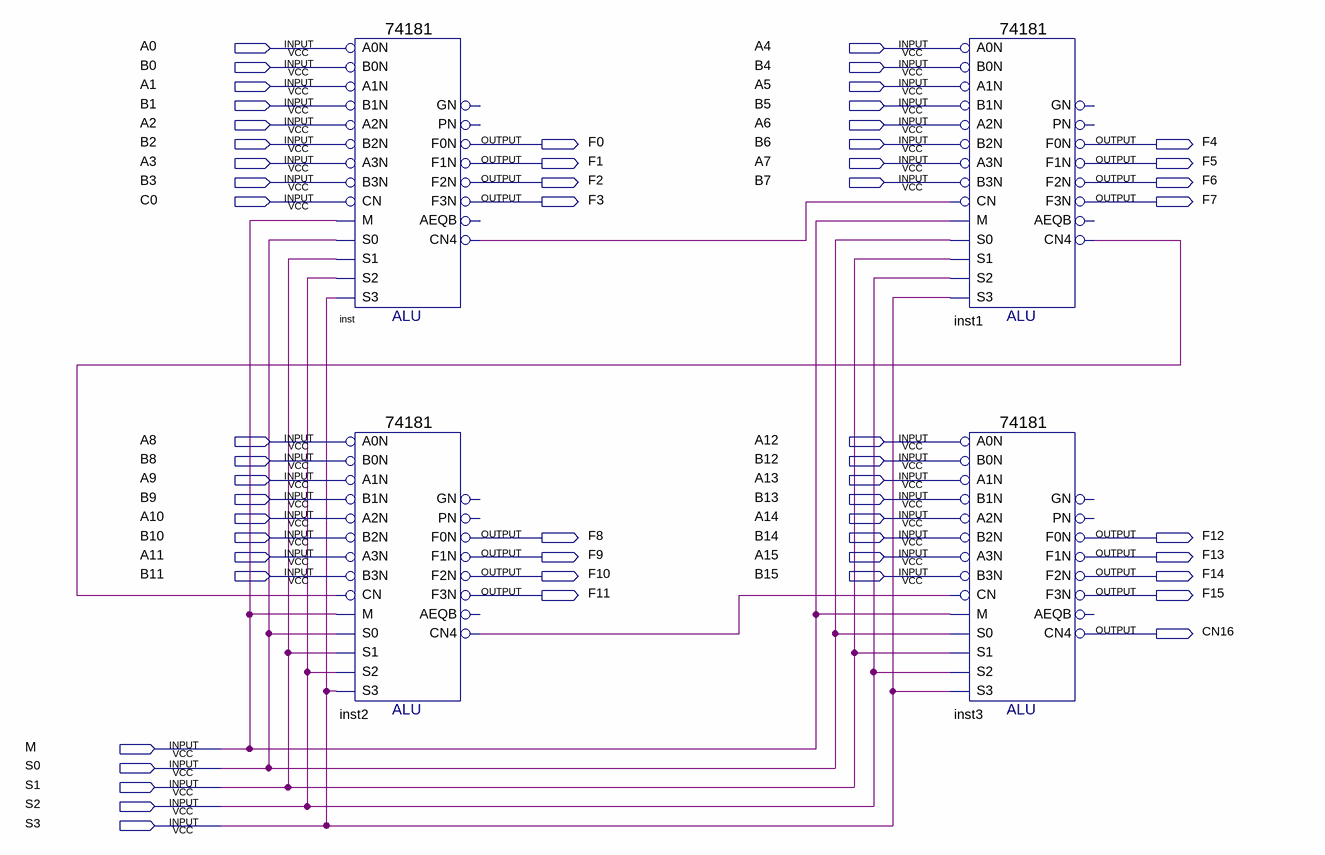
[diagram p0: schematic sheet]
// Quartus schematic serial.bdf as structural Verilog: 4 symbols, 55 pins
module serial (
  input  A0,
  input  A4,
  input  B0,
  input  B4,
  input  A1,
  input  A5,
  input  B1,
  input  B5,
  input  A2,
  input  A6,
  input  B2,
  input  B6,
  input  A3,
  input  A7,
  input  B3,
  input  B7,
  input  C0,
  input  A8,
  input  A12,
  input  B8,
  input  B12,
  input  A9,
  input  A13,
  input  B9,
  input  B13,
  input  A10,
  input  A14,
  input  B10,
  input  B14,
  input  A11,
  input  A15,
  input  B11,
  input  B15,
  input  M,
  input  S0,
  input  S1,
  input  S2,
  input  S3,
  output F0,
  output F4,
  output F1,
  output F5,
  output F2,
  output F6,
  output F3,
  output F7,
  output F8,
  output F12,
  output F9,
  output F13,
  output F10,
  output F14,
  output F11,
  output F15,
  output CN16
);

  wire inst1_cn4, inst2_cn4, inst_cn4;

  \74181  inst (
    .B0N(B0), .A0N(A0), .A1N(A1), .B1N(B1), .A3N(A3), .B2N(B2), .A2N(A2), .M(M), .CN(C0), .B3N(B3), .S2(S2),
    .S1(S1), .S0(S0), .S3(S3), .F3N(F3), .F1N(F1), .F0N(F0), .CN4(inst_cn4), .F2N(F2));  // open: PN, GN, AEQB
  \74181  inst2 (
    .B0N(B8), .A0N(A8), .A1N(A9), .B1N(B9), .A3N(A11), .B2N(B10), .A2N(A10), .M(M), .CN(inst1_cn4),
    .B3N(B11), .S2(S2), .S1(S1), .S0(S0), .S3(S3), .F3N(F11), .F1N(F9), .F0N(F8), .CN4(inst2_cn4), .F2N(F10));  // open: PN, GN, AEQB
  \74181  inst1 (
    .B0N(B4), .A0N(A4), .A1N(A5), .B1N(B5), .A3N(A7), .B2N(B6), .A2N(A6), .M(M), .CN(inst_cn4), .B3N(B7),
    .S2(S2), .S1(S1), .S0(S0), .S3(S3), .F3N(F7), .F1N(F5), .F0N(F4), .CN4(inst1_cn4), .F2N(F6));  // open: PN, GN, AEQB
  \74181  inst3 (
    .B0N(B12), .A0N(A12), .A1N(A13), .B1N(B13), .A3N(A15), .B2N(B14), .A2N(A14), .M(M), .CN(inst2_cn4),
    .B3N(B15), .S2(S2), .S1(S1), .S0(S0), .S3(S3), .F3N(F15), .F1N(F13), .F0N(F12), .CN4(CN16), .F2N(F14));  // open: PN, GN, AEQB
endmodule
